# Altium schematic sheet schematic.SchDoc
size A4; SheetNumber: 1; SheetTotal: 1
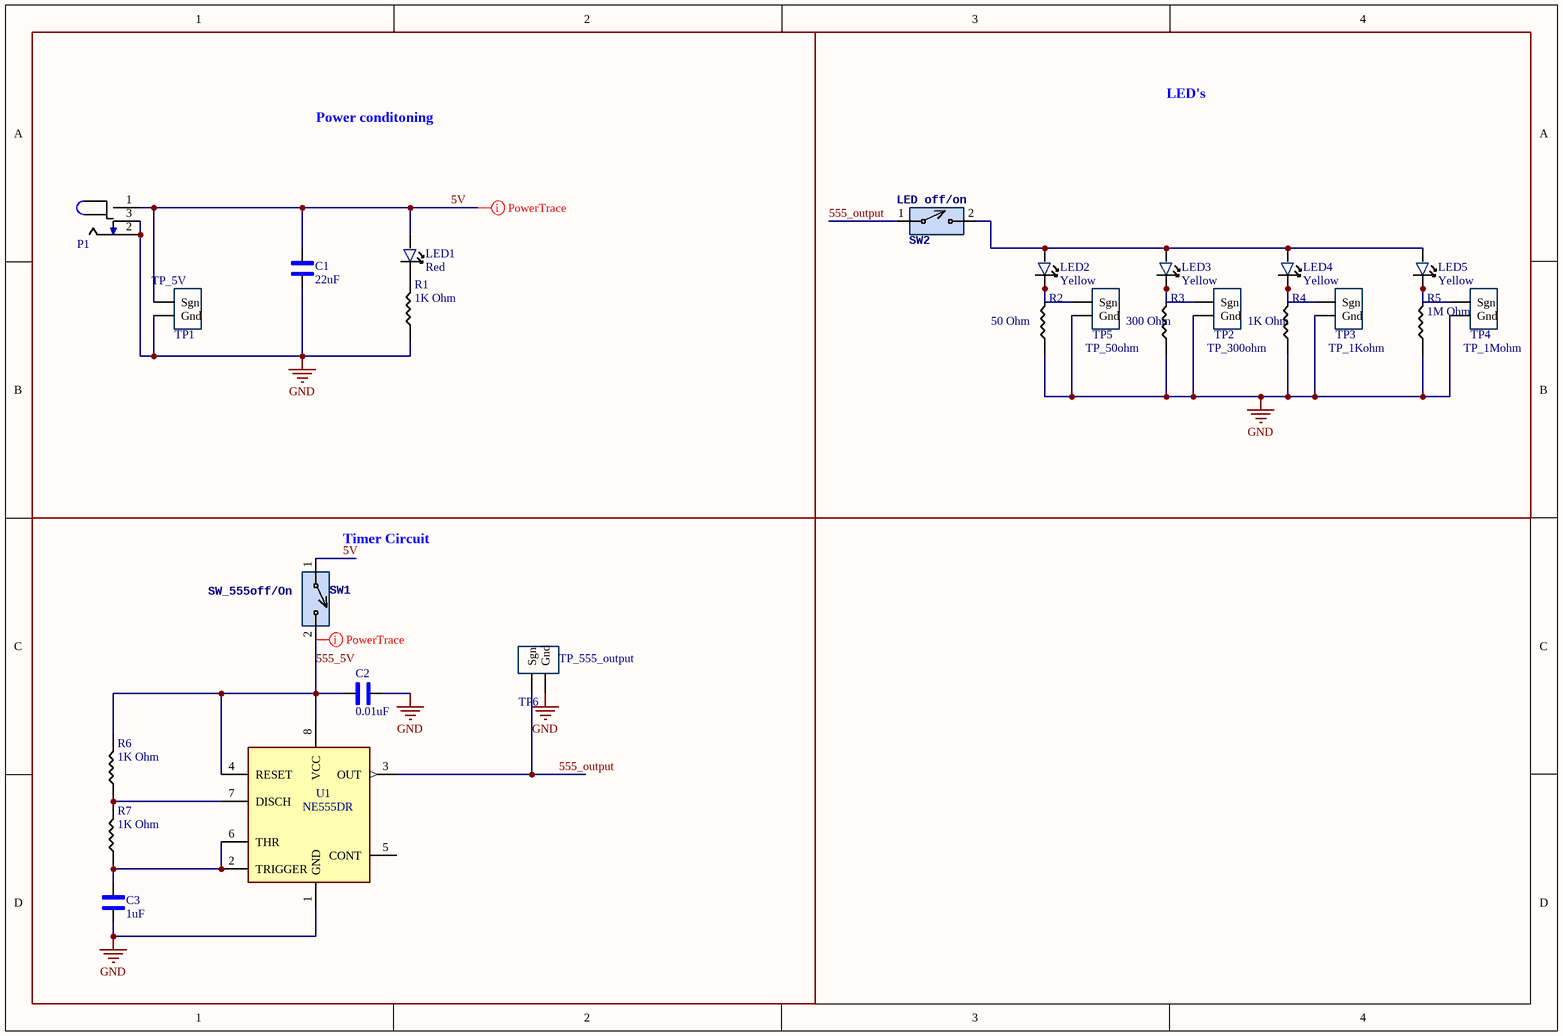
[diagram p0: schematic.SchDoc]

## Parts
C1  22uF  [1206_Passive_Capacitor]
C2  0.01uF  [1206_Passive_Capacitor]
C3  1uF  [1206_Passive_Capacitor]
LED1  Red  [LED_1206]
LED2  Yellow  [LED_1206]
LED3  Yellow  [LED_1206]
LED4  Yellow  [LED_1206]
LED5  Yellow  [LED_1206]
P1  Power Jack  [Power_Jack]  (value not drawn)
R1  value 1K Ohm  [1206_Passive_Resitor]  (hidden comment: 1k)
R2  value 50 Ohm  [1206_Passive_Resitor]  (hidden comment: 50)
R3  value 300 Ohm  [1206_Passive_Resitor]  (hidden comment: 300)
R4  value 1K Ohm  [1206_Passive_Resitor]  (hidden comment: 1k)
R5  value 1M Ohm  [1206_Passive_Resitor]  (hidden comment: 1M)
R6  value 1K Ohm  [1206_Passive_Resitor]  (hidden comment: 1k)
R7  value 1K Ohm  [1206_Passive_Resitor]  (hidden comment: 1k)
SW1  SW_555off/On  [2Pin-Header-Conn]
SW2  LED off/on  [2Pin-Header-Conn]
TP1  TP_5V  [TP10x_Probe]
TP2  TP_300ohm  [TP10x_Probe]
TP3  TP_1Kohm  [TP10x_Probe]
TP4  TP_1Mohm  [TP10x_Probe]
TP5  TP_50ohm  [TP10x_Probe]
TP6  TP_555_output  [TP10x_Probe]
U1  NE555DR  [TS555IDTTR]

## Blocks framed on the sheet
Power conditoning: C1 LED1 P1 R1 TP1

## Nets
GND: C1.1 C2.1 C3.2 P1.2 P1.3 R1.1 R2.1 R3.1 R4.1 R5.1 TP1.2(Gnd) TP2.2(Gnd) TP3.2(Gnd) TP4.2(Gnd) TP5.2(Gnd) TP6.2(Gnd) U1.1(GND)
5V: C1.2 LED1.1 P1.1 SW1.1 TP1.1(Sgn)
555_5V: C2.2 R6.2 SW1.2 U1.4(RESET) U1.8(VCC)
555_output: SW2.1 TP6.1(Sgn) U1.3(OUT)
NetC3_1: C3.1 R7.1 U1.2(TRIGGER) U1.6(THR)
NetLED1_2: LED1.2 R1.2
NetLED2_1: LED2.1 LED3.1 LED4.1 LED5.1 SW2.2
NetLED2_2: LED2.2 R2.2 TP5.1(Sgn)
NetLED3_2: LED3.2 R3.2 TP2.1(Sgn)
NetLED4_2: LED4.2 R4.2 TP3.1(Sgn)
NetLED5_2: LED5.2 R5.2 TP4.1(Sgn)
NetR6_1: R6.1 R7.2 U1.7(DISCH)

Not connected (* = marked no-connect by the designer): U1 5(CONT)

## Layout directives
rule Width Constraint [Pref Width = 20mil    Min Width = 10mil    Max Width = 100mil]: 5V, 555_5V

## Notes on the sheet
- LED's
- (near SW1) Timer Circuit

## Library data of the parts
C1 = C_22uF_1206: 22uF ±10% 25V X5R 1206 Multilayer Ceramic Capacitors MLCC - SMD/SMT RoHS; MFR Part #: CL31A226KAHNNNE; Type: basic; LCSC Part#: C12891; Datasheet: https://datasheet.lcsc.com/lcsc/1811031514_Samsung-Electro-Mechanics-CL31A226KAHNNNE_C12891.pdf; Value: 22uF
C2 C3 = C_1uF_1206: MULTILAYER CERAMIC CAPACITORS MLCC - SMD/SMT 1UF 50V 1206 ROHS; MFR Part #: CL31B105KBHNNNE; Type: Basic; Digikey Link: https://www.digikey.com/product-detail/en/C1206C105M4RACTU/399-8150-1-ND/3471873/?itemSeq=304982366; LCSC Part#: C1848
  C2: Value: 0.01uF
  C3: Value: 1uF
LED1 = LED_RED_1206: Red 621~631nm 1206 Light Emitting Diodes (LED) RoHS; MFR Part #: 15-21/R6C-FQ1R1B/2T; Type: Extended; LCSC Part#: C93133; Datasheet: https://datasheet.lcsc.com/szlcsc/1811151241_Everlight-Elec-15-21-R6C-FQ1R1B-2T_C93133.pdf; Value: Red
LED2-LED5 = LED_YELLOW_1206: yellow 1206  Light Emitting Diodes (LED) ROHS; MFR Part #: NCD1206Y1; Type: Extended; LCSC Part#: C93094; Datasheet: https://datasheet.lcsc.com/lcsc/2008201033_Foshan-NationStar-Optoelectronics-NCD1206Y1_C93094.pdf; Value: Yellow
P1 = P_Power Jack: Power Barrel Connector Jack 2.10mm ID (0.083"), 5.50mm OD (0.217") Through Hole, Right Angle; MFR Part #: PJ-102A; Value: CONN PWR JACK 2X5.5MM SOLDER; Digikey Link: https://www.digikey.com/product-detail/en/PJ-102A/CP-102A-ND/275425/?itemSeq=304982367; LCSC Part#: C136744; Type: Extended
R1-R7 = R_1K_1206: CHIP RESISTOR - SURFACE MOUNT 1KOHMS ±1% 1/4W 1206 ROHS; MFR Part #: RNCP1206FTD1K00CT; Digikey Link: https://www.digikey.com/product-detail/en/RNCP1206FTD1K00/RNCP1206FTD1K00CT-ND/2240675/?itemSeq=304982373; LCSC Part#: C4410; Type: Basic
SW1 SW2 = SW_2Pin_100mil_Switch: 2Pin Header; LCSC Part#: C124375; Type: Extended
TP1-TP6 = TP_10x_Probe: Test Point 300 mil centers
U1 = U_555_Slow: 555 Timer SOIC-8_150MIL ROHS 150ns Rise Time; MFR Part #: NE555DR; Digikey Link: https://www.digikey.com/product-detail/en/texas-instruments/NE555DR/296-6501-1-ND/372490; Type: Basic; LCSC Part#: C7593